# Altium schematic sheet 开关电源控制器SCH.SchDoc: 开关电源控制器及其控制和反馈电路
size 292 x 215 mm; Author: 许皓阳 15电4; DrawnBy: Staok
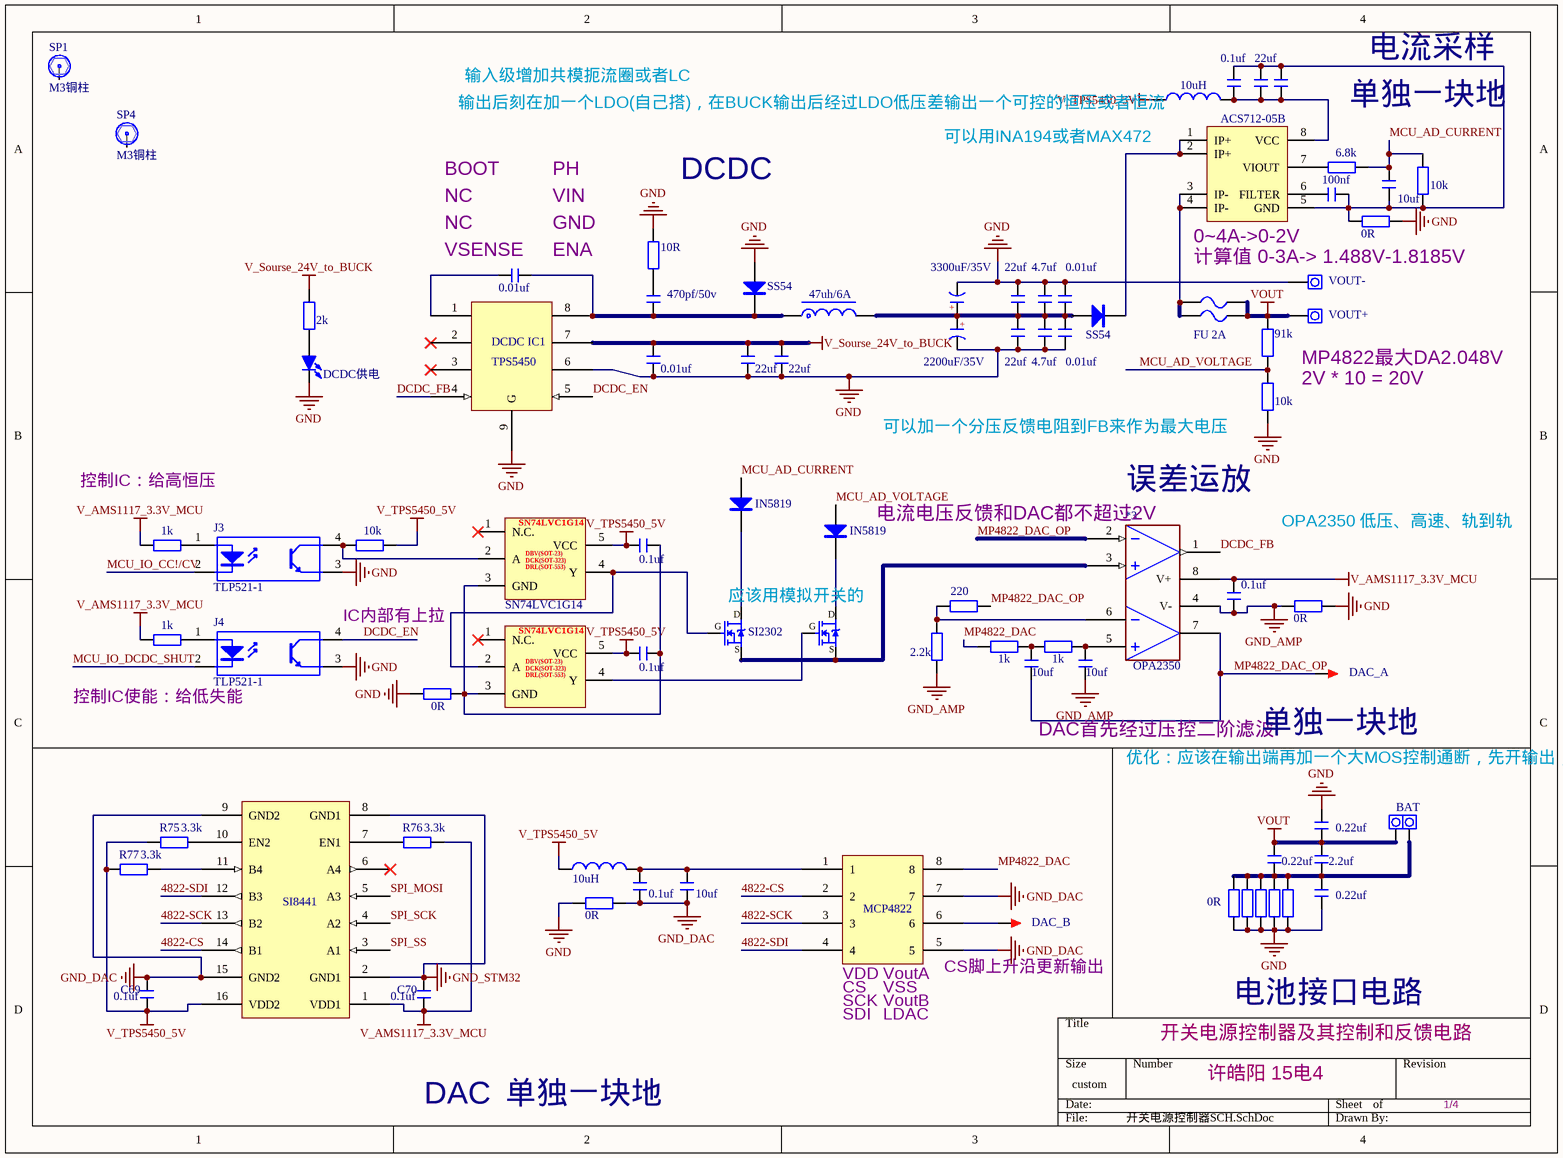
[diagram p0: 开关电源控制器SCH.SchDoc]

## Parts
7  10R  [R 0805_M]
8  SS54  [SMA]
9  SS54  [SMA]
10  2k  [R 0805_M]
11.  91k  [R 0805_M]
12.  10k  [R 0805_M]
13  220  [R 0805_M]
14  0R  [R 0805_M]
15  1k  [R 0805_M]
16  1k  [R 0805_M]
17  2.2k  [R 0805_M]
18  0R  [R 0805_M]  (value not drawn)
19  0R  [R 0805_M]  (value not drawn)
20  0R  [R 0805_M]  (value not drawn)
21  0R  [R 0805_M]
22  0R  [R 0805_M]  (value not drawn)
*2  SN74LVC1G14  [SOT23-5N]
*3  OPA2350  [SOP8_M]
*4  SN74LVC1G14  [SOT23-5N]  (value not drawn)
*5  SI8441  [SOP16W_N]
*6  MCP4822  [SOP8_M]
C41  0.1uf  [C 0805_M]
C42  22uf  [C 0805_M]
C43  22uf  [C 0805_M]  (value not drawn)
C44  100nf  [C 0805_M]
C45  10uf  [C 0805_M]
C46  0.01uf  [C 0805_M]
C47  22uf  [C 0805_M]
C48  4.7uf  [C 0805_M]
C49  0.01uf  [C 0805_M]
C50  470pf/50v  [C 0805_M]
C51  22uf  [C 0805_M]
C52  4.7uf  [C 0805_M]
C53  0.01uf  [C 0805_M]
C54  0.01uf  [C 0805_M]
C56  22uf  [C 0805_M]
C57  22uf  [C 0805_M]
C58  0.1uf  [C 0805_M]
C59  0.1uf  [C 0805_M]
C60  0.1uf  [C 0805_M]
C61  10uf  [C 0805_M]
C62  10uf  [C 0805_M]
C63  0.22uf  [C 0805_M]
C64  0.22uf  [C 0805_M]
C65  2.2uf  [C 0805_M]
C66  0.1uf  [C 0805_M]
C67  10uf  [C 0805_M]
C68  0.22uf  [C 0805_M]
C69  0.1uf  [C 0805_M]
C70  0.1uf  [C 0805_M]
D00  IN5819  [SOD-123]
D01  IN5819  [SOD-123]
DCDC_IC1  TPS5450  [ESOP8_M]
E3  3300uF/35V  [DIP2-5.08mm]
E5  2200uF/35V  [DIP2-5.08mm]
F4  FU 2A  [FU 1812]  (value not drawn)
F5  FU 2A  [FU 1812]
H2  VOUT-  [PAD1-SMD-C]
H3  VOUT+  [PAD1-SMD-C]
H4  BAT  [T_head]
IC2  ACS712-05B  [SOP8_N]
J3  TLP521-1  [SOP4-W2.54_N]
J4  TLP521-1  [SOP4-W2.54_N]
L5  10uH  [L 0805_M]
L6  47uh/6A  [L-SMD-0630]
L7  10uH  [L 0805_M]
LED6  DCDC供电  [LED 0805G]
Q7  SI2302  [SOT23-3N]
Q8  SI2302  [SOT23-3N]  (value not drawn)
R68  6.8k  [R 0805_M]
R69  10k  [R 0805_M]
R70  0R  [R 0805_M]
R71  1k  [R 0805_M]
R72  10k  [R 0805_M]
R73  1k  [R 0805_M]
R74  0R  [R 0805_M]
R75  3.3k  [R 0805_M]
R76  3.3k  [R 0805_M]
R77  3.3k  [R 0805_M]
R78  0R  [R 0805_M]
SP1  M3铜柱  [M3x4+6_N]
SP4  M3铜柱  [M3x4+6_N]
TP8  DAC_A  [TEST 1]
TP9  DAC_B  [TEST 1]

## Nets
GND: 7.2 8.1(A) 12..2 14.1 18.2 19.2 20.2 21.2 22.2 C47.2 C48.2 C49.2 C51.1 C52.1 C53.1 C54.1 C56.1 C57.1 C63.1 C68.2 DCDC_IC1.6 DCDC_IC1.9(G) E3.2(K) E5.2(K) H2.1 J3.3(E) J4.3(E) LED6.2(K) R70.1 R74.2 R78.2
GND_AMP: 14.2 17.2 *3.4(V-) C59.1 C62.1
GND_DAC: *5.9(GND2) *5.15(GND2) *6.5 *6.7 C66.1 C67.1 C69.2 R78.1
GND_STM32: *5.2(GND1) *5.8(GND1) C70.2
V_AMS1117_3.3V_MCU: *3.8(V+) *5.1(VDD1) C59.2 C70.1 R71.2 R73.2 R76.1
V_Sourse_24V_to_BUCK: 10.2 C54.2 C56.2 C57.2 DCDC_IC1.7
V_TPS5450_5V: *2.5(VCC) *4.5(VCC) *5.16(VDD2) C58.2 C60.2 C69.1 L5.1 L7.1 R72.2 R75.2 R77.2
VOUT: 11..1 C63.2 C64.1 C65.1 F4.2 F5.2 H3.1 H4.2
4822-CS: *5.14(B1) *6.2
4822-SCK: *5.13(B2) *6.3
4822-SDI: *5.12(B3) *6.4
DCDC_EN: DCDC_IC1.5 J4.4(C)
DCDC_FB: *3.1(Out_A) DCDC_IC1.4
MCU_AD_CURRENT: C45.1 D00.1(A) R68.1 R69.1
MCU_AD_VOLTAGE: 11..2 12..1 D01.1(A)
MCU_IO_CC!/CV: J3.2(K)
MCU_IO_DCDC_SHUT: J4.2(K)
MP4822_DAC: 15.2 *6.8
MP4822_DAC_OP: 13.2 *3.2(In_A-) *3.7(Out_B) C61.1 TP8.1
SPI_MOSI: *5.5(A3)
SPI_SCK: *5.4(A2)
SPI_SS: *5.3(A1)
Net7_1: 7.1 C50.2
Net8_2: 8.2(K) C46.2 C50.1 DCDC_IC1.8 L6.1
Net9_1: 9.1(A) C47.1 C48.1 C49.1 C51.2 C52.2 C53.2 E3.1(A) E5.1(A) L6.2
Net9_2: 9.2(K) IC2.1(IP+) IC2.2(IP+)
Net10_1: 10.1 LED6.1(A)
Net13_1: 13.1 17.1 *3.6(In_B-)
Net15_1: 15.1 16.2 C61.2
Net16_1: 16.1 *3.5(In_B+) C62.2
Net18_1: 18.1 19.1 20.1 21.1 22.1 C64.2 C65.2 C68.1 H4.1
Net*2_2: *2.2(A) J3.4(C) R72.1
Net*2_3: *2.3(GND) *4.3(GND) C58.1 C60.1 R74.1
Net*2_4: *2.4(Y) *4.2(A) Q7.1(G)
Net*3_3: *3.3(In_A+) Q7.2(S) Q8.2(S)
Net*4_4: *4.4(Y) Q8.1(G)
Net*5_7: *5.7(EN1) R76.2
Net*5_10: *5.10(EN2) R75.1
Net*5_11: *5.11(B4) R77.1
Net*6_1: *6.1 C66.2 C67.2 L7.2
Net*6_6: *6.6 TP9.1
NetC41_1: C41.1 C42.1 C43.1 IC2.8(VCC) L5.2
NetC41_2: C41.2 C42.2 C43.2 C44.1 C45.2 IC2.5(GND) R69.2 R70.2
NetC44_2: C44.2 IC2.6(FILTER)
NetC46_1: C46.1 DCDC_IC1.1
NetD00_2: D00.2(K) Q7.3(D)
NetD01_2: D01.2(K) Q8.3(D)
NetF4_1: F4.1 F5.1 IC2.3(IP-) IC2.4(IP-)
NetIC2_7: IC2.7(VIOUT) R68.2
NetJ3_1: J3.1(A) R71.1
NetJ4_1: J4.1(A) R73.1

Not connected (* = marked no-connect by the designer): *2 1(N.C.)*; *4 1(N.C.)*; *5 6(A4)*; DCDC_IC1 2* 3*; SP1 1; SP4 1

## Notes on the sheet
- 输入级增加共模扼流圈或者LC
- 电流采样
- 输出后刻在加一个LDO(自己搭)，在BUCK输出后经过LDO低压差输出一个可控的恒压或者恒流
- 可以用INA194或者MAX472
- 单独一块地
- BOOT
- NC
- GND
- VIN
- PH
- DCDC
- (near C46) VSENSE
- ENA
- (near IC2) 0~4A->0-2V
- (near H2) 计算值 0-3A-> 1.488V-1.8185V
- MP4822最大DA2.048V
- 可以加一个分压反馈电阻到FB来作为最大电压
- 2V * 10 = 20V
- 控制IC：给高恒压
- (near *3) 误差运放
- (near D01) 电流电压反馈和DAC都不超过2V
- OPA2350 低压、高速、轨到轨
- IC内部有上拉
- 应该用模拟开关的
- 控制IC使能：给低失能
- DAC首先经过压控二阶滤波
- 优化：应该在输出端再加一个大MOS控制通断，先开输出，再开负载
- (near TP8) 单独一块地
- CS脚上升沿更新输出
- (near *6) VDD
- (near *6) CS
- (near *6) SCK
- SDI
- (near *6) VoutA
- (near *6) VSS
- (near *6) VoutB
- LDAC
- 电池接口电路
- DAC
- 1/4
- (in symbol C-CAP) +
- (in symbol SN74LVC1G14) DBV(SOT-23); DCK(SOT-323); DRL(SOT-553)

## Library data of the parts
7 10 11. 12. 13-22 R68-R78 = R: 贴片电阻; 版权归属: 源创客; BOM名称: 贴片电阻; 学习资源: www.ooocke.com
8 9 = SS34: 肖特基二极管; 版权归属: 源创客; 属性: 40V/3A; BOM名称: 肖特基二极管; 学习资源: www.ooocke.com
*3 = OPA2277
*6 = 8
C41-C54 C56-C70 = C: 无极性贴片电容; 版权归属: 源创客; BOM名称: 无极性贴片电容; 学习资源: www.ooocke.com
D00 D01 = 1N5819: 肖特基二极管; 版权归属: 源创客; 属性: 40V/2A; BOM名称: 肖特基二极管; 学习资源: www.ooocke.com
DCDC_IC1 = ESOP8
E3 E5 = C-CAP: 直插电解电容; 版权归属: 源创客; BOM名称: 直插电解电容; 学习资源: www.ooocke.com
F4 F5 = FU: 贴片保险丝; 版权归属: 源创客; BOM名称: 贴片保险丝; 学习资源: www.ooocke.com
H2 H3 = PAD1: 引线焊盘; 版权归属: 源创客; BOM名称: 引线焊盘; 学习资源: www.ooocke.com
H4 = PAD2: 引线焊盘; 版权归属: 源创客; BOM名称: 引线焊盘; 学习资源: www.ooocke.com
IC2 = ACS712: 电流检测芯片; 版权归属: 源创客; BOM名称: 电流检测芯片; 学习资源: www.ooocke.com
J3 J4 = TLP521-1: 1路开关光耦; 版权归属: 源创客; BOM名称: 1路开关光耦; 学习资源: www.ooocke.com
L5 L7 = L: 小功率贴片电感; 版权归属: 源创客; BOM名称: 小功率贴片电感; 学习资源: www.ooocke.com
L6 = L-CDRH: 功率屏蔽电感; 版权归属: 源创客; BOM名称: 功率屏蔽电感; 学习资源: www.ooocke.com
LED6 = LED-SMD: 贴片LED; 版权归属: 源创客; BOM名称: 贴片LED; 学习资源: www.ooocke.com
Q7 Q8 = SI2302: N沟道 20V/3A; BOM名称: 场效应管; 版权归属: 源创客; 学习资源: www.ooocke.com; 描述: N沟道 20V/3A
SP1 SP4 = 铜柱加头大焊盘: 铜柱; 版权归属: 源创客; BOM名称: 铜柱; 学习资源: www.ooocke.com
TP8 TP9 = TEST: 测试点; 版权归属: 源创客; BOM名称: 测试点; 学习资源: www.ooocke.com